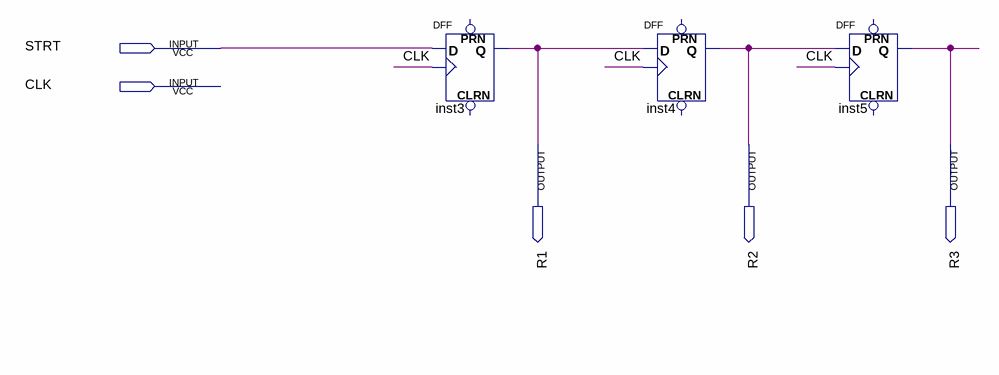
[diagram p0: schematic sheet]
// Quartus schematic Kaunt.bdf as structural Verilog: 3 symbols, 5 pins
module Kaunt (
  input  STRT,
  input  CLK,
  output R1,
  output R2,
  output R3
);

  DFF inst3 (.CLK(CLK), .D(STRT), .Q(R1));  // open: CLRN, PRN
  DFF inst4 (.CLK(CLK), .D(R1), .Q(R2));  // open: CLRN, PRN
  DFF inst5 (.CLK(CLK), .D(R2), .Q(R3));  // open: CLRN, PRN
endmodule
